# EAGLE schematic counter_shield (EAGLE 6.4)
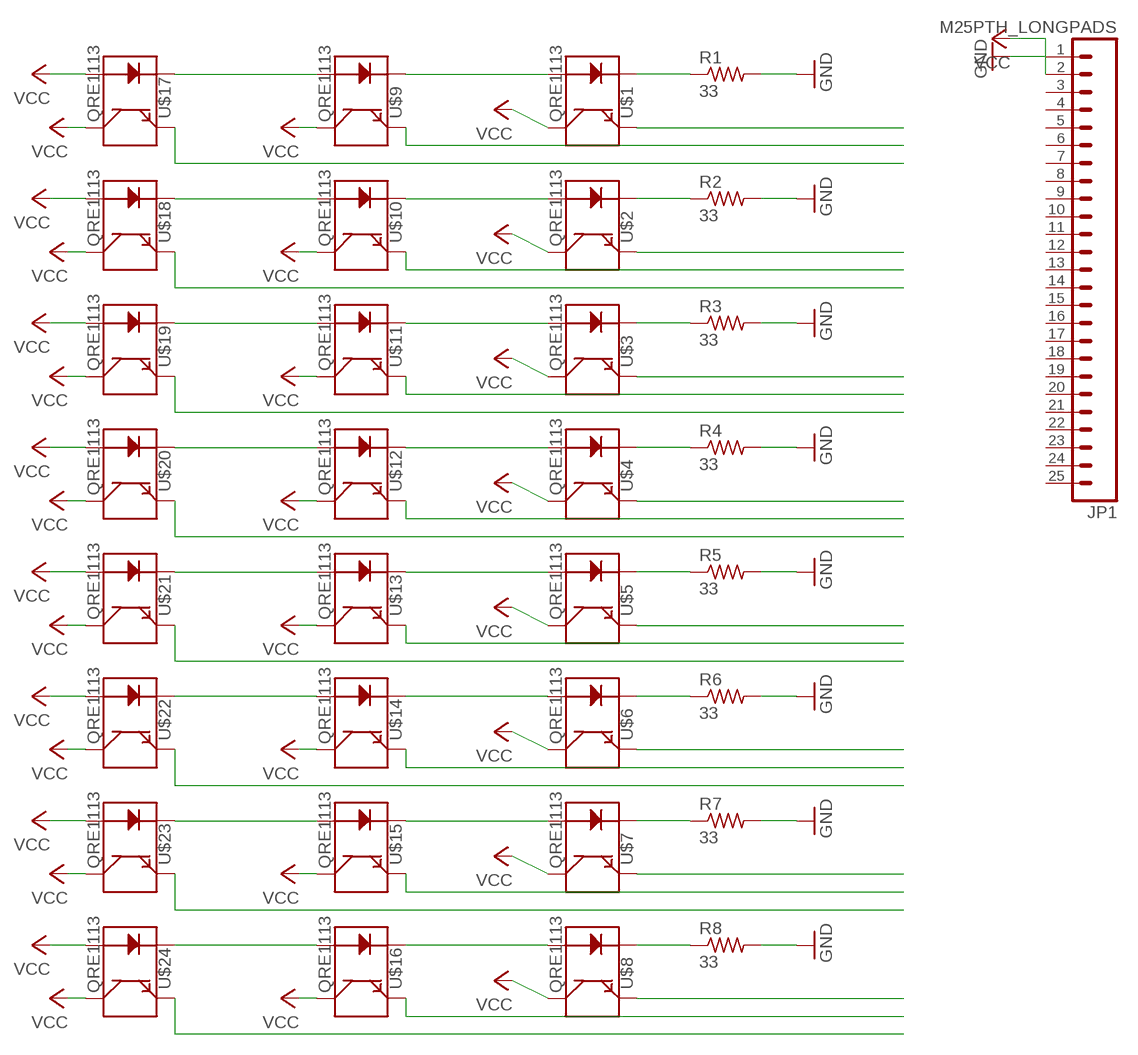
[diagram p0: schematic, sheet 1]

## Parts
JP1  M25PTH_LONGPADS  [1X25_LONGPAD]
R1  33  RESISTOR1206  [1206]
R2  33  RESISTOR1206  [1206]
R3  33  RESISTOR1206  [1206]
R4  33  RESISTOR1206  [1206]
R5  33  RESISTOR1206  [1206]
R6  33  RESISTOR1206  [1206]
R7  33  RESISTOR1206  [1206]
R8  33  RESISTOR1206  [1206]
U$1  QRE1113  [QRE1113]
U$2  QRE1113  [QRE1113]
U$3  QRE1113  [QRE1113]
U$4  QRE1113  [QRE1113]
U$5  QRE1113  [QRE1113]
U$6  QRE1113  [QRE1113]
U$7  QRE1113  [QRE1113]
U$8  QRE1113  [QRE1113]
U$9  QRE1113  [QRE1113]
U$10  QRE1113  [QRE1113]
U$11  QRE1113  [QRE1113]
U$12  QRE1113  [QRE1113]
U$13  QRE1113  [QRE1113]
U$14  QRE1113  [QRE1113]
U$15  QRE1113  [QRE1113]
U$16  QRE1113  [QRE1113]
U$17  QRE1113  [QRE1113]
U$18  QRE1113  [QRE1113]
U$19  QRE1113  [QRE1113]
U$20  QRE1113  [QRE1113]
U$21  QRE1113  [QRE1113]
U$22  QRE1113  [QRE1113]
U$23  QRE1113  [QRE1113]
U$24  QRE1113  [QRE1113]

## Nets
GND: JP1.2 R1.2 R2.2 R3.2 R4.2 R5.2 R6.2 R7.2 R8.2
N$1: U$9.1(A) U$17.2(K)
N$2: U$1.1(A) U$9.2(K)
N$3: U$10.1(A) U$18.2(K)
N$4: U$2.1(A) U$10.2(K)
N$5: U$3.1(A) U$11.2(K)
N$6: U$11.1(A) U$19.2(K)
N$7: U$12.1(A) U$20.2(K)
N$8: U$4.1(A) U$12.2(K)
N$9: U$13.1(A) U$21.2(K)
N$10: U$5.1(A) U$13.2(K)
N$11: U$6.1(A) U$14.2(K)
N$12: U$14.1(A) U$22.2(K)
N$13: U$15.1(A) U$23.2(K)
N$14: U$7.1(A) U$15.2(K)
N$15: U$8.1(A) U$16.2(K)
N$16: U$16.1(A) U$24.2(K)
N$17: R8.1 U$8.2(K)
N$18: R7.1 U$7.2(K)
N$19: R6.1 U$6.2(K)
N$20: R5.1 U$5.2(K)
N$21: R4.1 U$4.2(K)
N$22: R3.1 U$3.2(K)
N$23: R2.1 U$2.2(K)
N$24: R1.1 U$1.2(K)
N$25: U$17.4(E)
N$26: U$9.4(E)
N$27: U$1.4(E)
N$28: U$18.4(E)
N$29: U$10.4(E)
N$30: U$2.4(E)
N$31: U$19.4(E)
N$32: U$11.4(E)
N$33: U$3.4(E)
N$34: U$20.4(E)
N$35: U$12.4(E)
N$36: U$4.4(E)
N$37: U$21.4(E)
N$38: U$13.4(E)
N$39: U$5.4(E)
N$40: U$22.4(E)
N$41: U$14.4(E)
N$42: U$6.4(E)
N$43: U$23.4(E)
N$44: U$15.4(E)
N$45: U$7.4(E)
N$46: U$24.4(E)
N$47: U$16.4(E)
N$48: U$8.4(E)
VCC: JP1.1 U$1.3(C) U$2.3(C) U$3.3(C) U$4.3(C) U$5.3(C) U$6.3(C) U$7.3(C) U$8.3(C) U$9.3(C) U$10.3(C) U$11.3(C) U$12.3(C) U$13.3(C) U$14.3(C) U$15.3(C) U$16.3(C) U$17.1(A) U$17.3(C) U$18.1(A) U$18.3(C) U$19.1(A) U$19.3(C) U$20.1(A) U$20.3(C) U$21.1(A) U$21.3(C) U$22.1(A) U$22.3(C) U$23.1(A) U$23.3(C) U$24.1(A) U$24.3(C)
Unconnected: JP1.3 JP1.4 JP1.5 JP1.6 JP1.7 JP1.8 JP1.9 JP1.10 JP1.11 JP1.12 JP1.13 JP1.14 JP1.15 JP1.16 JP1.17 JP1.18 JP1.19 JP1.20 JP1.21 JP1.22 JP1.23 JP1.24 JP1.25

## Library data of the parts
JP1 = SparkFun-Connectors:M25: 1x25 .1" header
R1-R8 = 01_ng:RESISTOR
U$1-U$24 = SparkFun-Sensors:QRE1113: Reflective object sensor